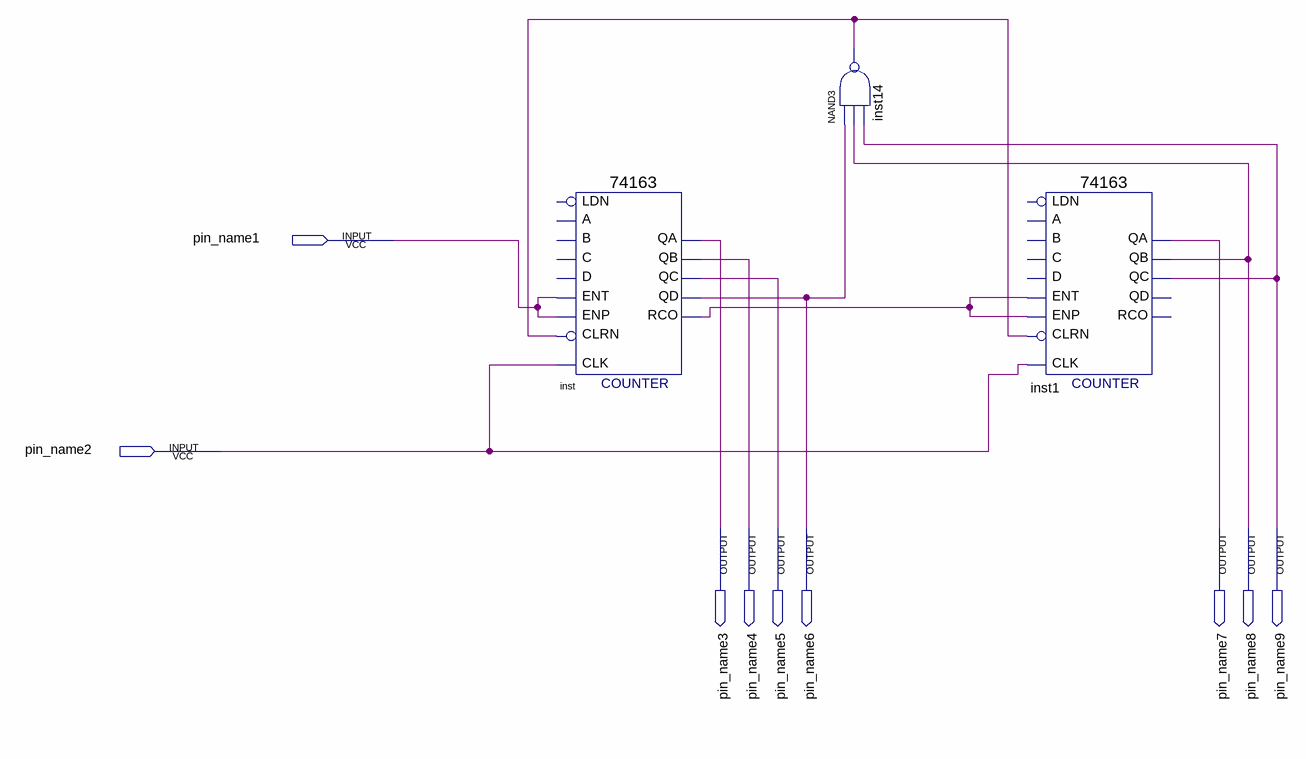
[diagram p0: schematic sheet]
// Quartus schematic licznik74163.bdf as structural Verilog: 3 symbols, 9 pins
module licznik74163 (
  input  pin_name1,
  input  pin_name2,
  output pin_name3,
  output pin_name4,
  output pin_name5,
  output pin_name6,
  output pin_name7,
  output pin_name8,
  output pin_name9
);

  wire inst14_out, inst_rco;

  \74163  inst (
    .ENT(pin_name1), .CLRN(inst14_out), .CLK(pin_name2), .ENP(pin_name1), .QA(pin_name3), .QB(pin_name4),
    .QC(pin_name5), .QD(pin_name6), .RCO(inst_rco));  // open: C, B, A, D, LDN
  nand inst14 (inst14_out, pin_name6, pin_name8, pin_name9);
  \74163  inst1 (
    .ENT(inst_rco), .CLRN(inst14_out), .CLK(pin_name2), .ENP(inst_rco), .QA(pin_name7), .QB(pin_name8),
    .QC(pin_name9));  // open: C, B, A, D, LDN, QD, RCO
endmodule
